# Altium schematic sheet Project_Overview.SchDoc: Project overview
size A4; Date: Not used; ApprovedBy: Not used; CheckedBy: Not used; Author: Ph.A; CompanyName: STMicroelectronics; DrawnBy: Not used; Engineer: Not used; Organization: Not used; Address1: Not used; Address2: Not used; Address3: Not used; Address4: Not used; DocumentNumber: Not used; Revision: Not used; SheetNumber: 1; SheetTotal: 2; CurrentTime: Not used; CurrentDate: Not used; Time: Not used; DocumentFullPathAndName: Not used; DocumentName: Not used; ModifiedDate: Not used; ImagePath: Not used; ProjectName: Not used; Application_BuildNumber: Not used
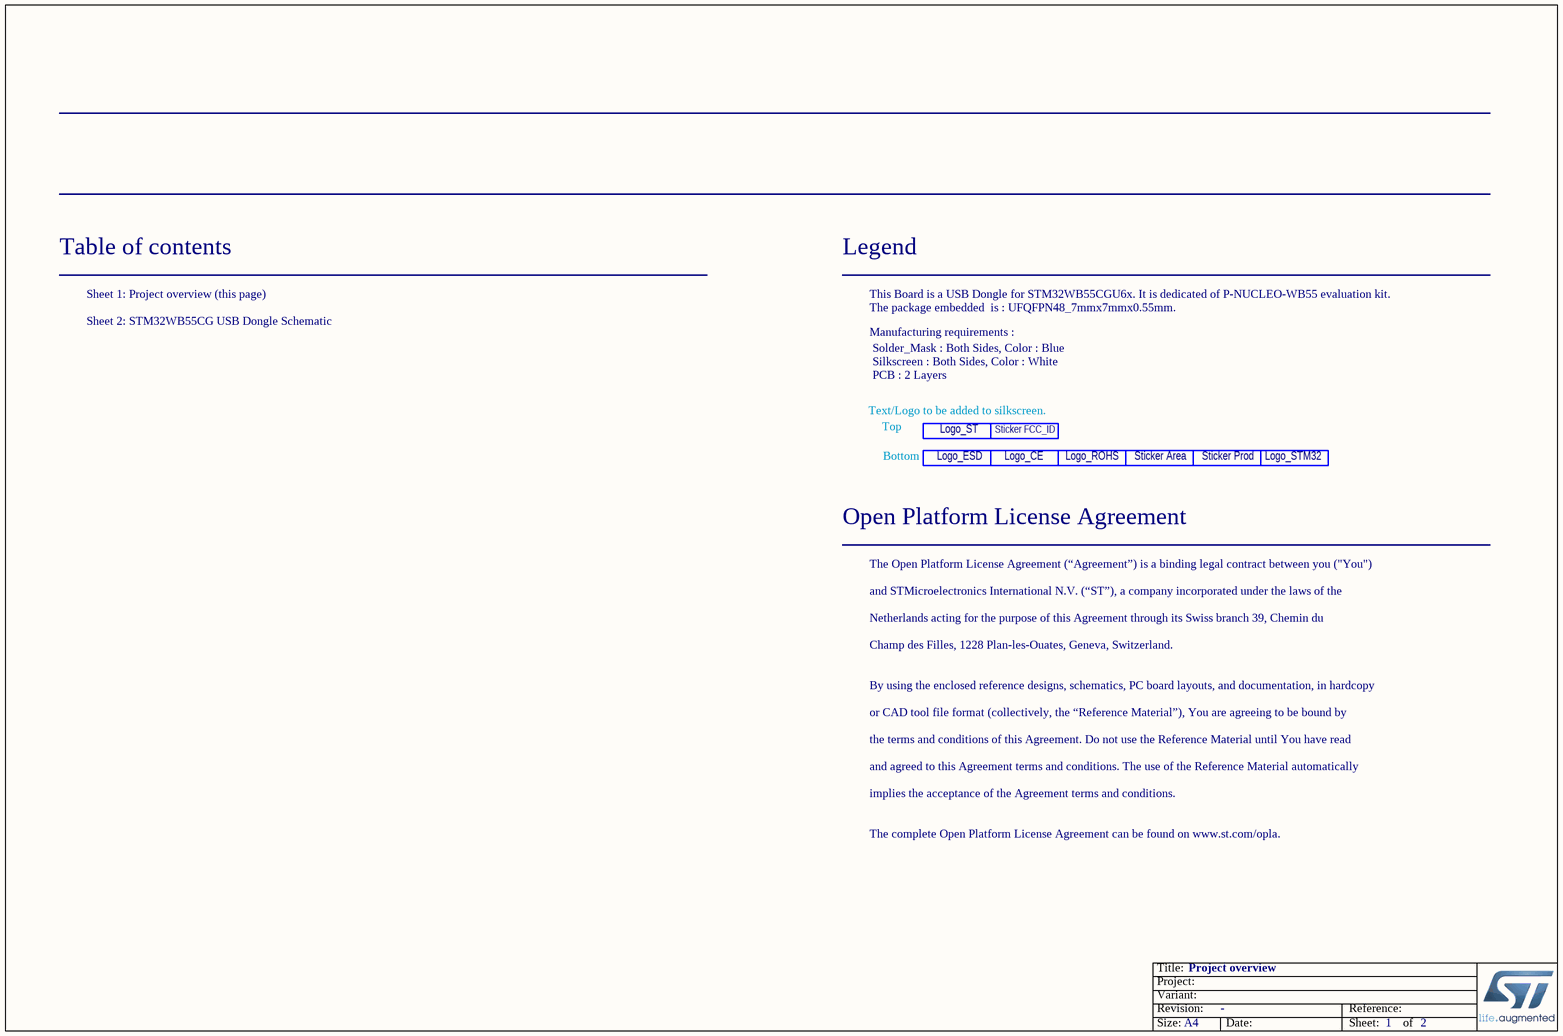
[diagram p0: Project_Overview.SchDoc]

## Parts
Label_1  LOGO_ST  [LOGO_ST_Size2]  (value not drawn)
Label_2  LOGO_ROHS  [SYMBOL_RoHS]  (value not drawn)
Label_3  LOGO_StickerArea_Prod_Reservation  [LOGO_Sticker_Area]  (value not drawn)
Label_4  LOGO_STM32  [LOGO_STM32]  (value not drawn)
Label_6  LOGO_CE  [LOGO CE]  (value not drawn)
Label_7  LOGO_ESD  [LOGO ESD]  (value not drawn)
STICKER_1  FCC_ID_Sticker_16x6  [Sticker_FCC_ID 16x6mm]  (value not drawn)
STICKER_2  Sticker_Prod_22x6  [Sticker_Prod_22x6mm]  (value not drawn)

## Notes on the sheet
- Table of contents
- Sheet 1: Project overview (this page)
- Legend
- This Board is a USB Dongle for STM32WB55CGU6x. It is dedicated of P-NUCLEO-WB55 evaluation kit.
- The package embedded  is : UFQFPN48_7mmx7mmx0.55mm.
- Sheet 2: STM32WB55CG USB Dongle Schematic
- Manufacturing requirements :
- Silkscreen : Both Sides, Color : White
- Solder_Mask : Both Sides, Color : Blue
- (near Label_1) PCB : 2 Layers
- Text/Logo to be added to silkscreen.
- Top
- Bottom
- Open Platform License Agreement
- The Open Platform License Agreement (“Agreement”) is a binding legal contract between you ("You")
- and STMicroelectronics International N.V. (“ST”), a company incorporated under the laws of the
- Netherlands acting for the purpose of this Agreement through its Swiss branch 39, Chemin du
- Champ des Filles, 1228 Plan-les-Ouates, Geneva, Switzerland.
- By using the enclosed reference designs, schematics, PC board layouts, and documentation, in hardcopy
- or CAD tool file format (collectively, the “Reference Material”), You are agreeing to be bound by
- the terms and conditions of this Agreement. Do not use the Reference Material until You have read
- and agreed to this Agreement terms and conditions. The use of the Reference Material automatically
- implies the acceptance of the Agreement terms and conditions.
- The complete Open Platform License Agreement can be found on www.st.com/opla.
- Title:
- Project:
- Size:
- Revision:
- Variant:
- A4
- -
- Date:
- Reference:
- Sheet:
- of
- (in symbol LOGO_CE) Logo_CE
- (in symbol LOGO_ESD) Logo_ESD
- (in symbol LOGO_ROHS) Logo_ROHS
- (in symbol LOGO_ST) Logo_ST
- (in symbol LOGO_Sticker_FCC_ID) Sticker FCC_ID
- (in symbol LOGO_Sticker_Prod) Sticker Prod
- (in symbol LOGO_StickerArea_Prod_Reservation) Sticker Area
- (in symbol LOGO_STM32) Logo_STM32

## Library data of the parts
Label_1 = LOGO_ST: Silkscreen Only: YES
Label_2 = LOGO_ROHS: Silkscreen Only: YES
Label_3 = LOGO_StickerArea_Prod_Reservation: Area Resevation for Prod Sticker 22x6mm; Silkscreen Only: YES
Label_4 = LOGO_STM32: Silkscreen Only: YES
Label_6 = LOGO_CE: Silkscreen Only: YES
Label_7 = LOGO_ESD: Silkscreen Only: YES
STICKER_1 = LOGO_Sticker_FCC_ID: Sticker for FCC_ID 16x6mm
STICKER_2 = LOGO_Sticker_Prod: Prod Sticker 22x6mm